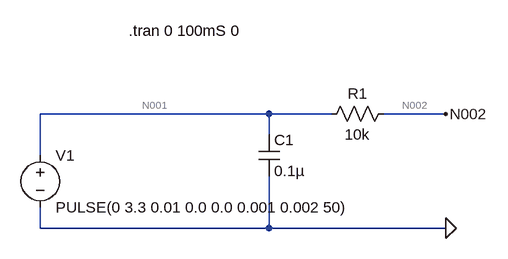
[diagram p0: schematic pwm_rc_filter.asc]
pwm_rc_filter.asc, the LTspice schematic file:
Version 4
SHEET 1 880 680
WIRE -576 176 -928 176
WIRE -480 176 -576 176
WIRE -304 176 -400 176
WIRE -576 208 -576 176
WIRE -928 240 -928 176
WIRE -928 352 -928 320
WIRE -576 352 -576 272
WIRE -576 352 -928 352
WIRE -304 352 -576 352
FLAG -304 352 0
IOPIN -304 352 Out
FLAG -304 176 N002
SYMBOL voltage -928 224 R0
SYMATTR InstName V1
SYMATTR Value PULSE(0 3.3 0.01 0.0 0.0 0.001 0.002 50)
SYMBOL cap -592 208 R0
SYMATTR InstName C1
SYMATTR Value 0.1µ
SYMATTR SpiceLine Rser=0 Lser=0 mfg="   ---" pn="   ---" type="   ---"
SYMBOL res -384 160 R90
WINDOW 0 0 56 VBottom 2
WINDOW 3 32 56 VTop 2
SYMATTR InstName R1
SYMATTR Value 10k
TEXT -792 48 Left 2 !.tran 0 100mS 0

The netlist it stands for:
* pwm_rc_filter.asc
V1 N001 0 PULSE(0 3.3 0.01 0.0 0.0 0.001 0.002 50)
C1 N001 0 0.1µ Rser=0 Lser=0 mfg="   ---" pn="   ---" type="   ---"
R1 N002 N001 10k
.tran 0 100mS 0
.backanno
.end

* Results of the author's LTspice run, read from the files saved beside the schematic
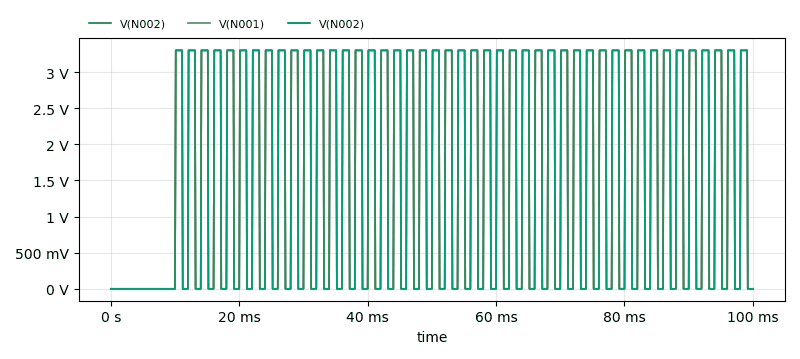
[diagram p1: Transient Analysis of pwm_rc_filter.asc, plotted from the saved traces]
* Transient Analysis, 1 run:
*   V(N002): min 0 V, max 3.3 V, average 1.633 V, rms 2.315 V, last 0 V
*   V(N001): min 0 V, max 3.3 V, average 1.633 V, rms 2.315 V, last 0 V
*   V(N002): min 0 V, max 3.3 V, average 1.633 V, rms 2.315 V, last 0 V